# EasyEDA Pro project OptoGrid_V0.05.eprj, schematic OptoGrid_uLEDArray_V0.05
Board Name: OptoGrid_uLEDArray_V0.05; Create Date: 2025-07-05; Page Name: Sheet_1; Project Name: OptoGrid_V0.05; Schematic Name: OptoGrid_uLEDArray_V0.05; Update Date: 2025-09-04; Company: 嘉立创EDA; Drawed: Fukui (Daniel) Yang; Page Size: A4; Version: V1.0
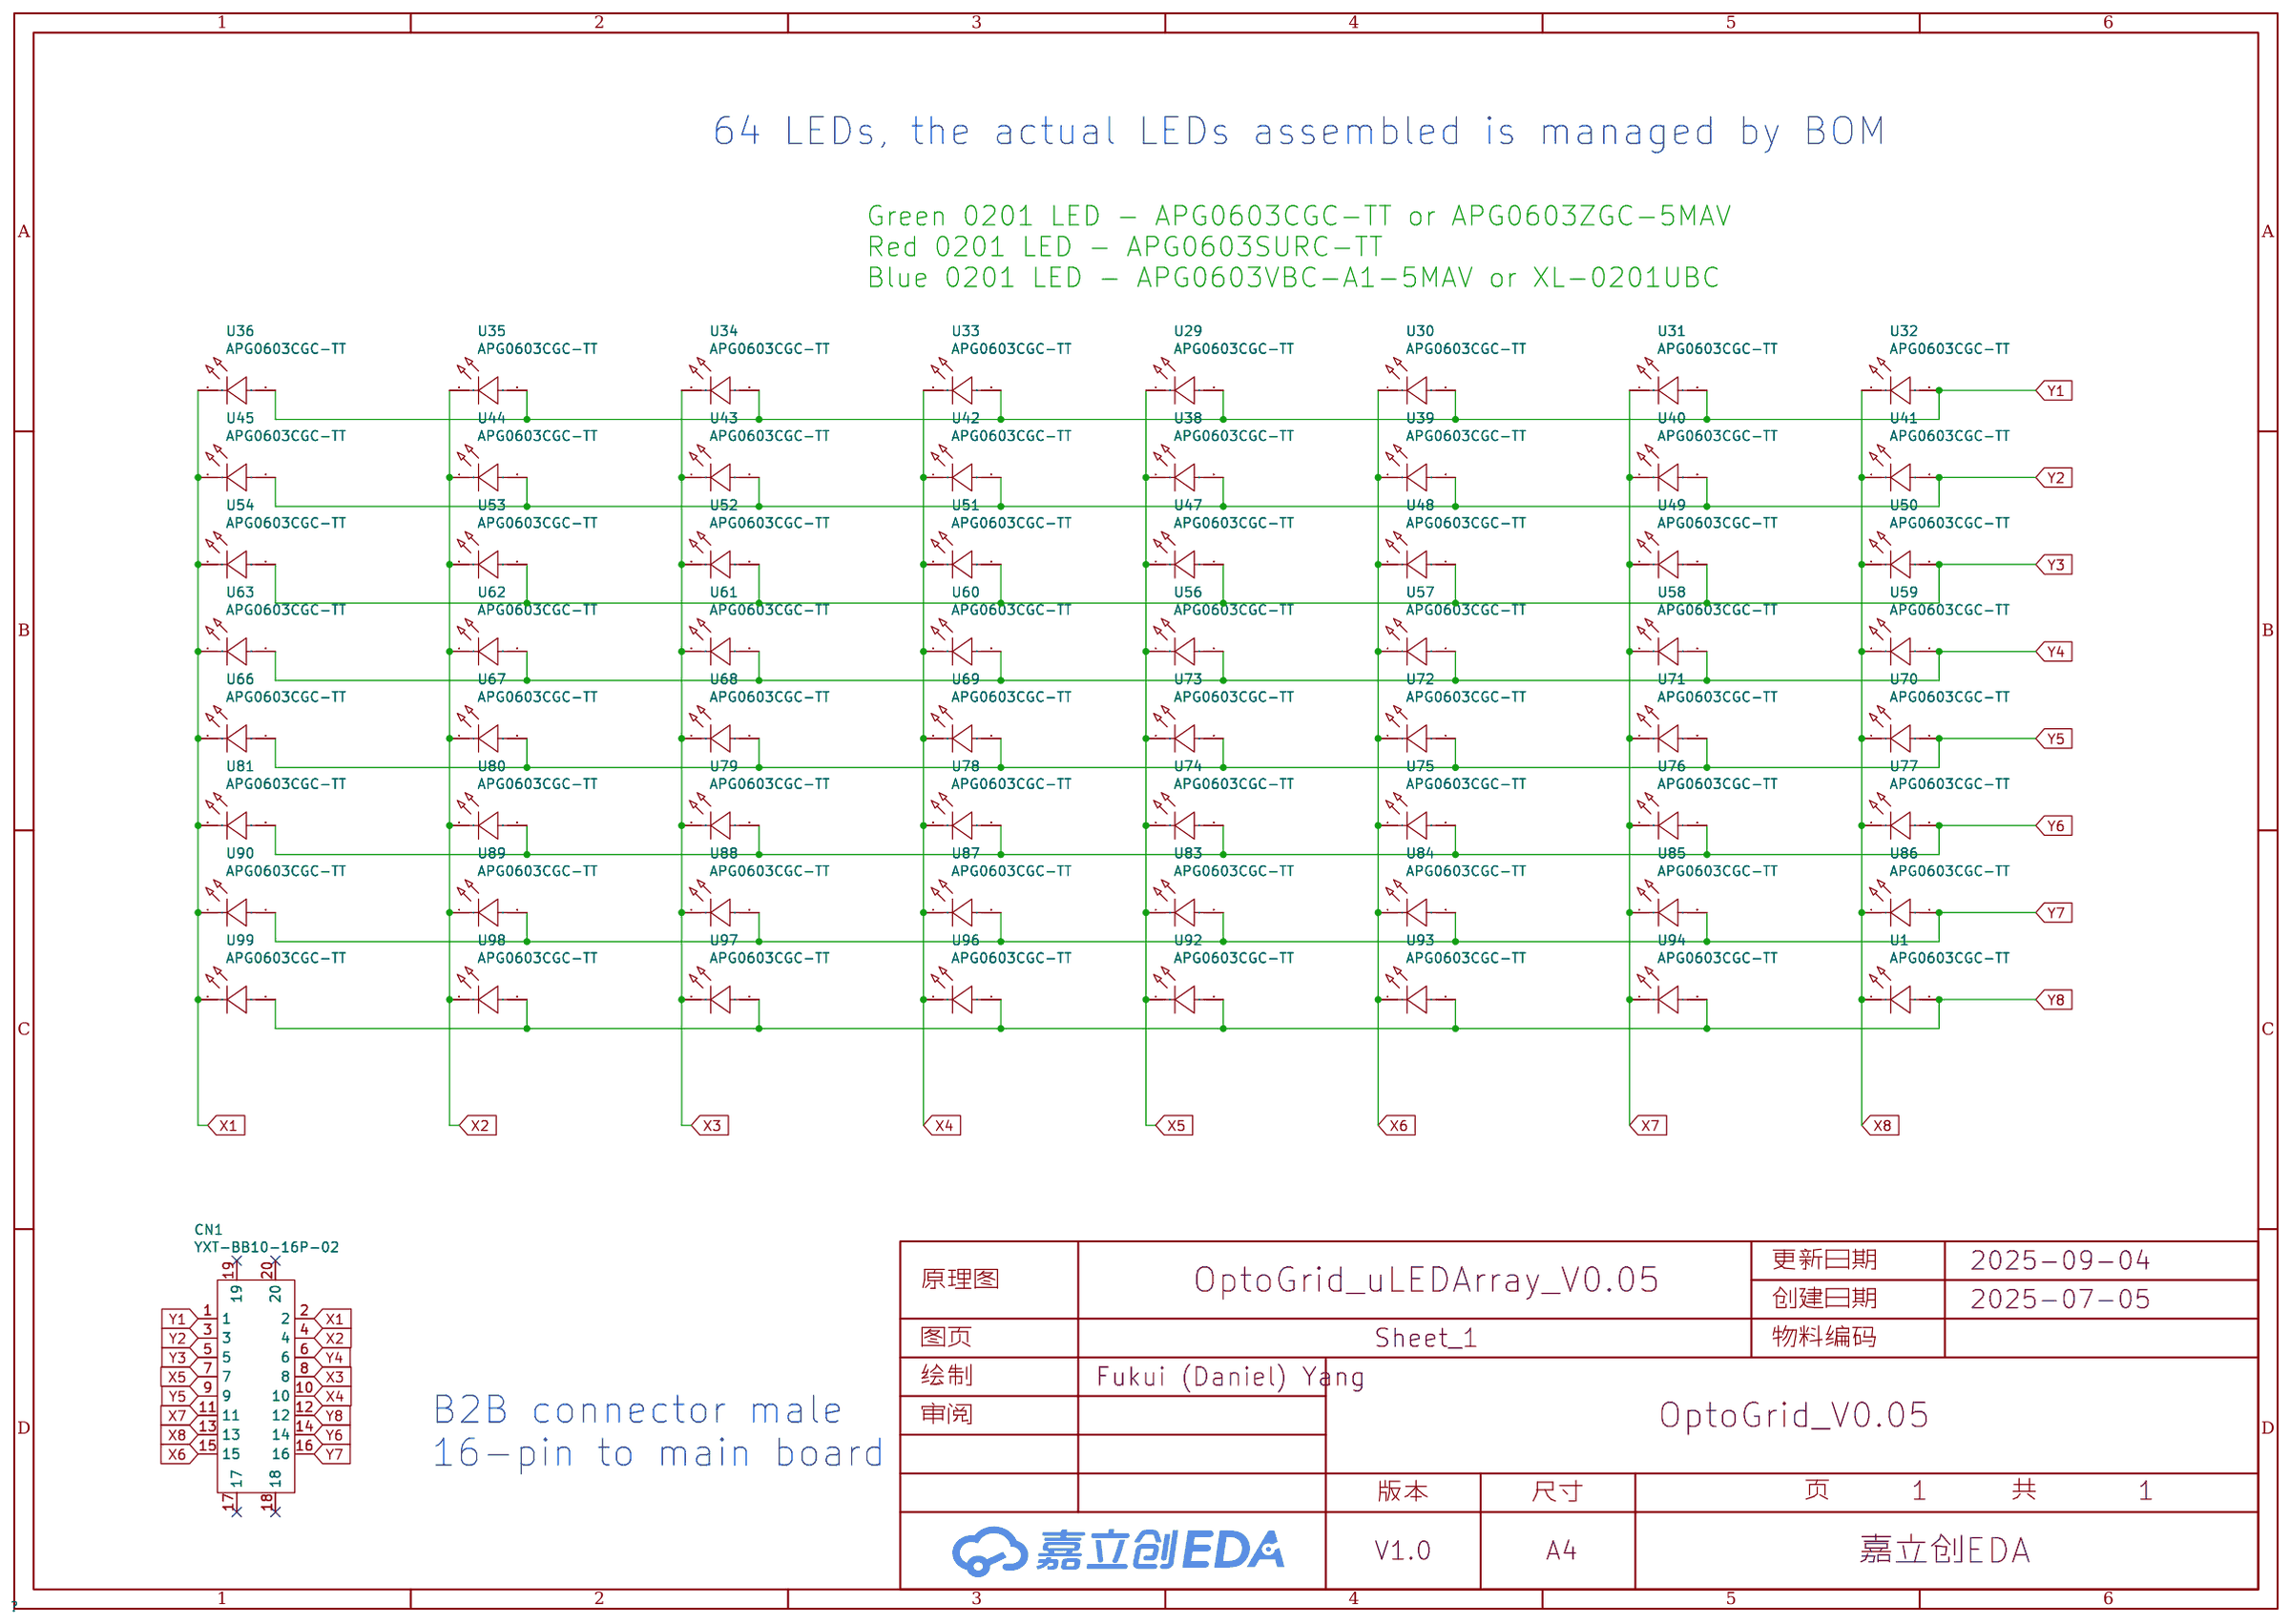
[diagram p2: schematic sheet]

## Parts
CN1  YXT-BB10-16P-02  [CONN-SMD_YXT-BB10-16P-02]
U1  APG0603CGC-TT  [BLUE_LED_KINGBRIGHT_0201]
U29  APG0603CGC-TT  [BLUE_LED_KINGBRIGHT_0201]
U30  APG0603CGC-TT  [BLUE_LED_KINGBRIGHT_0201]
U31  APG0603CGC-TT  [BLUE_LED_KINGBRIGHT_0201]
U32  APG0603CGC-TT  [BLUE_LED_KINGBRIGHT_0201]
U33  APG0603CGC-TT  [BLUE_LED_KINGBRIGHT_0201]
U34  APG0603CGC-TT  [BLUE_LED_KINGBRIGHT_0201]
U35  APG0603CGC-TT  [BLUE_LED_KINGBRIGHT_0201]
U36  APG0603CGC-TT  [BLUE_LED_KINGBRIGHT_0201]
U38  APG0603CGC-TT  [BLUE_LED_KINGBRIGHT_0201]
U39  APG0603CGC-TT  [BLUE_LED_KINGBRIGHT_0201]
U40  APG0603CGC-TT  [BLUE_LED_KINGBRIGHT_0201]
U41  APG0603CGC-TT  [BLUE_LED_KINGBRIGHT_0201]
U42  APG0603CGC-TT  [BLUE_LED_KINGBRIGHT_0201]
U43  APG0603CGC-TT  [BLUE_LED_KINGBRIGHT_0201]
U44  APG0603CGC-TT  [BLUE_LED_KINGBRIGHT_0201]
U45  APG0603CGC-TT  [BLUE_LED_KINGBRIGHT_0201]
U47  APG0603CGC-TT  [BLUE_LED_KINGBRIGHT_0201]
U48  APG0603CGC-TT  [BLUE_LED_KINGBRIGHT_0201]
U49  APG0603CGC-TT  [BLUE_LED_KINGBRIGHT_0201]
U50  APG0603CGC-TT  [BLUE_LED_KINGBRIGHT_0201]
U51  APG0603CGC-TT  [BLUE_LED_KINGBRIGHT_0201]
U52  APG0603CGC-TT  [BLUE_LED_KINGBRIGHT_0201]
U53  APG0603CGC-TT  [BLUE_LED_KINGBRIGHT_0201]
U54  APG0603CGC-TT  [BLUE_LED_KINGBRIGHT_0201]
U56  APG0603CGC-TT  [BLUE_LED_KINGBRIGHT_0201]
U57  APG0603CGC-TT  [BLUE_LED_KINGBRIGHT_0201]
U58  APG0603CGC-TT  [BLUE_LED_KINGBRIGHT_0201]
U59  APG0603CGC-TT  [BLUE_LED_KINGBRIGHT_0201]
U60  APG0603CGC-TT  [BLUE_LED_KINGBRIGHT_0201]
U61  APG0603CGC-TT  [BLUE_LED_KINGBRIGHT_0201]
U62  APG0603CGC-TT  [BLUE_LED_KINGBRIGHT_0201]
U63  APG0603CGC-TT  [BLUE_LED_KINGBRIGHT_0201]
U66  APG0603CGC-TT  [BLUE_LED_KINGBRIGHT_0201]
U67  APG0603CGC-TT  [BLUE_LED_KINGBRIGHT_0201]
U68  APG0603CGC-TT  [BLUE_LED_KINGBRIGHT_0201]
U69  APG0603CGC-TT  [BLUE_LED_KINGBRIGHT_0201]
U70  APG0603CGC-TT  [BLUE_LED_KINGBRIGHT_0201]
U71  APG0603CGC-TT  [BLUE_LED_KINGBRIGHT_0201]
U72  APG0603CGC-TT  [BLUE_LED_KINGBRIGHT_0201]
U73  APG0603CGC-TT  [BLUE_LED_KINGBRIGHT_0201]
U74  APG0603CGC-TT  [BLUE_LED_KINGBRIGHT_0201]
U75  APG0603CGC-TT  [BLUE_LED_KINGBRIGHT_0201]
U76  APG0603CGC-TT  [BLUE_LED_KINGBRIGHT_0201]
U77  APG0603CGC-TT  [BLUE_LED_KINGBRIGHT_0201]
U78  APG0603CGC-TT  [BLUE_LED_KINGBRIGHT_0201]
U79  APG0603CGC-TT  [BLUE_LED_KINGBRIGHT_0201]
U80  APG0603CGC-TT  [BLUE_LED_KINGBRIGHT_0201]
U81  APG0603CGC-TT  [BLUE_LED_KINGBRIGHT_0201]
U83  APG0603CGC-TT  [BLUE_LED_KINGBRIGHT_0201]
U84  APG0603CGC-TT  [BLUE_LED_KINGBRIGHT_0201]
U85  APG0603CGC-TT  [BLUE_LED_KINGBRIGHT_0201]
U86  APG0603CGC-TT  [BLUE_LED_KINGBRIGHT_0201]
U87  APG0603CGC-TT  [BLUE_LED_KINGBRIGHT_0201]
U88  APG0603CGC-TT  [BLUE_LED_KINGBRIGHT_0201]
U89  APG0603CGC-TT  [BLUE_LED_KINGBRIGHT_0201]
U90  APG0603CGC-TT  [BLUE_LED_KINGBRIGHT_0201]
U92  APG0603CGC-TT  [BLUE_LED_KINGBRIGHT_0201]
U93  APG0603CGC-TT  [BLUE_LED_KINGBRIGHT_0201]
U94  APG0603CGC-TT  [BLUE_LED_KINGBRIGHT_0201]
U96  APG0603CGC-TT  [BLUE_LED_KINGBRIGHT_0201]
U97  APG0603CGC-TT  [BLUE_LED_KINGBRIGHT_0201]
U98  APG0603CGC-TT  [BLUE_LED_KINGBRIGHT_0201]
U99  APG0603CGC-TT  [BLUE_LED_KINGBRIGHT_0201]

## Library data of the parts
CN1 = YXT-BB10-16P-02: Supplier: LCSC; Supplier Part: C2763972; Manufacturer: YXT(益鑫通）; JLCPCB Part Class: Extended Part
U1 U29-U36 U38-U45 U47-U54 U56-U63 U66-U81 U83-U90 U92-U94 U96-U99 = APG0603VBC-A1-5MAV: Supplier: LCSC; Supplier Part: C4153580; Manufacturer: Kingbright; JLCPCB Part Class: Extended Part

## Nets
X1: CN1.2 U36.1(K) U45.1(K) U54.1(K) U63.1(K) U66.1(K) U81.1(K) U90.1(K) U99.1(K)
X2: CN1.4 U35.1(K) U44.1(K) U53.1(K) U62.1(K) U67.1(K) U80.1(K) U89.1(K) U98.1(K)
X3: CN1.8 U34.1(K) U43.1(K) U52.1(K) U61.1(K) U68.1(K) U79.1(K) U88.1(K) U97.1(K)
X4: CN1.10 U33.1(K) U42.1(K) U51.1(K) U60.1(K) U69.1(K) U78.1(K) U87.1(K) U96.1(K)
X5: CN1.7 U29.1(K) U38.1(K) U47.1(K) U56.1(K) U73.1(K) U74.1(K) U83.1(K) U92.1(K)
X6: CN1.15 U30.1(K) U39.1(K) U48.1(K) U57.1(K) U72.1(K) U75.1(K) U84.1(K) U93.1(K)
X7: CN1.11 U31.1(K) U40.1(K) U49.1(K) U58.1(K) U71.1(K) U76.1(K) U85.1(K) U94.1(K)
X8: CN1.13 U1.1(K) U32.1(K) U41.1(K) U50.1(K) U59.1(K) U70.1(K) U77.1(K) U86.1(K)
Y1: CN1.1 U29.2(A) U30.2(A) U31.2(A) U32.2(A) U33.2(A) U34.2(A) U35.2(A) U36.2(A)
Y2: CN1.3 U38.2(A) U39.2(A) U40.2(A) U41.2(A) U42.2(A) U43.2(A) U44.2(A) U45.2(A)
Y3: CN1.5 U47.2(A) U48.2(A) U49.2(A) U50.2(A) U51.2(A) U52.2(A) U53.2(A) U54.2(A)
Y4: CN1.6 U56.2(A) U57.2(A) U58.2(A) U59.2(A) U60.2(A) U61.2(A) U62.2(A) U63.2(A)
Y5: CN1.9 U66.2(A) U67.2(A) U68.2(A) U69.2(A) U70.2(A) U71.2(A) U72.2(A) U73.2(A)
Y6: CN1.14 U74.2(A) U75.2(A) U76.2(A) U77.2(A) U78.2(A) U79.2(A) U80.2(A) U81.2(A)
Y7: CN1.16 U83.2(A) U84.2(A) U85.2(A) U86.2(A) U87.2(A) U88.2(A) U89.2(A) U90.2(A)
Y8: CN1.12 U1.2(A) U92.2(A) U93.2(A) U94.2(A) U96.2(A) U97.2(A) U98.2(A) U99.2(A)

Not connected (* = marked no-connect by the designer): CN1 17* 18* 19* 20*

## Notes on the sheet
- 64 LEDs, the actual LEDs assembled is managed by BOM
- Green 0201 LED - APG0603CGC-TT or APG0603ZGC-5MAV
  Red 0201 LED - APG0603SURC-TT
  Blue 0201 LED - APG0603VBC-A1-5MAV or XL-0201UBC
- B2B connector male
  16-pin to main board
